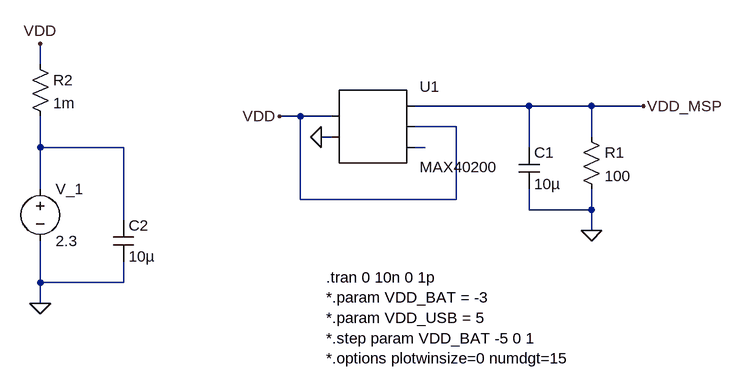
[diagram p0: schematic MAX40203Test.asc]
MAX40203Test.asc, the LTspice schematic file:
Version 4
SHEET 1 888 800
WIRE -352 368 -352 336
WIRE 400 432 224 432
WIRE 496 432 400 432
WIRE 576 432 496 432
WIRE 48 448 16 448
WIRE 96 448 48 448
WIRE 288 464 224 464
WIRE 96 480 80 480
WIRE 496 480 496 432
WIRE -352 496 -352 448
WIRE -224 496 -352 496
WIRE 240 496 224 496
WIRE 400 496 400 432
WIRE -352 560 -352 496
WIRE 48 576 48 448
WIRE 288 576 288 464
WIRE 288 576 48 576
WIRE 400 592 400 560
WIRE 496 592 496 560
WIRE 496 592 400 592
WIRE -224 608 -224 496
WIRE 496 624 496 592
WIRE -352 704 -352 640
WIRE -224 704 -224 672
WIRE -224 704 -352 704
WIRE -352 736 -352 704
FLAG 576 432 VDD_MSP
FLAG 496 624 0
FLAG 16 448 VDD
FLAG 80 480 0
FLAG -352 736 0
FLAG -352 336 VDD
SYMBOL res 480 464 R0
SYMATTR InstName R1
SYMATTR Value 100
SYMBOL cap 384 496 R0
SYMATTR InstName C1
SYMATTR Value 10µ
SYMBOL cap -240 608 R0
SYMATTR InstName C2
SYMATTR Value 10µ
SYMBOL voltage -352 544 R0
SYMATTR InstName V_1
SYMATTR Value 2.3
SYMBOL res -368 352 R0
SYMATTR InstName R2
SYMATTR Value 1m
SYMBOL AutoGenerated/MAX40200 160 464 R0
SYMATTR InstName U1
TEXT 88 696 Left 2 !.tran 0 10n 0 1p\n*.param VDD_BAT = -3\n*.param VDD_USB = 5\n*.step param VDD_BAT -5 0 1\n*.options plotwinsize=0 numdgt=15

The netlist it stands for:
* MAX40203Test.asc
R1 VDD_MSP 0 100
C1 VDD_MSP 0 10µ
C2 N001 0 10µ
V_1 N001 0 2.3
R2 VDD N001 1m
* U1: MAX40200 (symbol AutoGenerated/MAX40200 not available, pins judged from their places): pin1=VDD pin2=0 pin3=VDD_MSP pin4=VDD pin5=N002
.tran 0 10n 0 1p
*.param VDD_BAT = -3
*.param VDD_USB = 5
*.step param VDD_BAT -5 0 1
*.options plotwinsize=0 numdgt=15
.backanno
.end